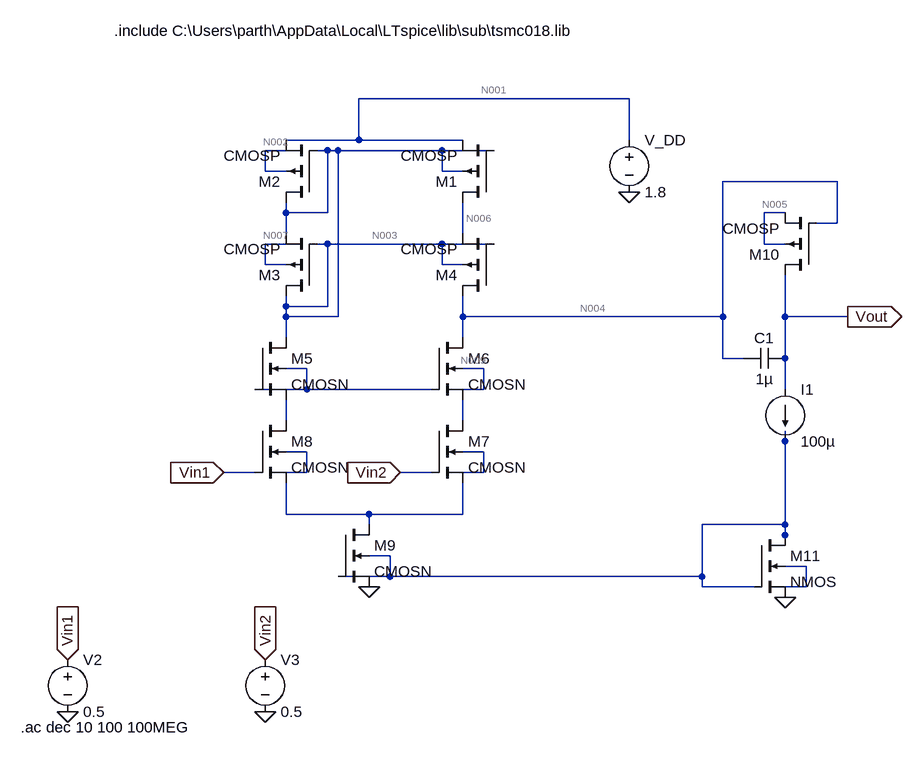
[diagram p0: schematic Draft2.asc]
Draft2.asc, the LTspice schematic file:
Version 4
SHEET 1 1312 1096
WIRE 864 112 448 112
WIRE 448 176 448 112
WIRE 448 176 336 176
WIRE 608 176 448 176
WIRE 864 176 864 112
WIRE 336 192 304 192
WIRE 400 192 384 192
WIRE 416 192 400 192
WIRE 576 192 416 192
WIRE 656 192 576 192
WIRE 304 224 304 192
WIRE 336 224 304 224
WIRE 576 224 576 192
WIRE 608 224 576 224
WIRE 1184 240 1008 240
WIRE 336 288 336 272
WIRE 400 288 400 192
WIRE 400 288 336 288
WIRE 1104 288 1072 288
WIRE 1184 304 1184 240
WIRE 1184 304 1152 304
WIRE 336 320 336 288
WIRE 608 320 608 272
WIRE 336 336 304 336
WIRE 400 336 384 336
WIRE 576 336 400 336
WIRE 656 336 576 336
WIRE 1072 336 1072 288
WIRE 1104 336 1072 336
WIRE 304 368 304 336
WIRE 336 368 304 368
WIRE 576 368 576 336
WIRE 608 368 576 368
WIRE 336 432 336 416
WIRE 400 432 400 336
WIRE 400 432 336 432
WIRE 336 448 336 432
WIRE 416 448 416 192
WIRE 416 448 336 448
WIRE 608 448 608 416
WIRE 1008 448 1008 240
WIRE 1008 448 608 448
WIRE 1104 448 1104 384
WIRE 1200 448 1104 448
WIRE 336 480 336 448
WIRE 608 480 608 448
WIRE 1008 512 1008 448
WIRE 1040 512 1008 512
WIRE 1104 512 1104 448
WIRE 368 528 336 528
WIRE 640 528 608 528
WIRE 368 560 368 528
WIRE 368 560 288 560
WIRE 560 560 368 560
WIRE 640 560 640 528
WIRE 640 560 608 560
WIRE 1104 560 1104 512
WIRE 336 608 336 576
WIRE 608 608 608 576
WIRE 1104 640 1104 624
WIRE 368 656 336 656
WIRE 640 656 608 656
WIRE 288 688 240 688
WIRE 368 688 368 656
WIRE 368 688 336 688
WIRE 560 688 512 688
WIRE 640 688 640 656
WIRE 640 688 608 688
WIRE 336 752 336 704
WIRE 464 752 336 752
WIRE 608 752 608 704
WIRE 608 752 464 752
WIRE 464 768 464 752
WIRE 1104 768 1104 640
WIRE 1104 768 976 768
WIRE 1104 784 1104 768
WIRE 1104 800 1104 784
WIRE 496 816 464 816
WIRE 1136 832 1104 832
WIRE 496 848 496 816
WIRE 496 848 416 848
WIRE 976 848 976 768
WIRE 976 848 496 848
WIRE 976 864 976 848
WIRE 1056 864 976 864
WIRE 1136 864 1136 832
WIRE 1136 864 1104 864
FLAG 464 864 0
FLAG 864 256 0
FLAG 1200 448 Vout
IOPIN 1200 448 Out
FLAG 240 688 Vin1
IOPIN 240 688 In
FLAG 512 688 Vin2
IOPIN 512 688 In
FLAG 0 976 Vin1
IOPIN 0 976 In
FLAG 304 976 Vin2
IOPIN 304 976 In
FLAG 0 1056 0
FLAG 304 1056 0
FLAG 1104 880 0
SYMBOL pmos4 656 272 R180
SYMATTR InstName M1
SYMATTR Value CMOSP
SYMATTR Value2 l=0.5u w=20u
SYMBOL pmos4 384 272 R180
SYMATTR InstName M2
SYMATTR Value CMOSP
SYMATTR Value2 l=0.5u w=20u
SYMBOL pmos4 384 416 R180
SYMATTR InstName M3
SYMATTR Value CMOSP
SYMATTR Value2 l=0.5u w=20u
SYMBOL pmos4 656 416 R180
SYMATTR InstName M4
SYMATTR Value CMOSP
SYMATTR Value2 l=0.5u w=20u
SYMBOL nmos4 288 480 R0
SYMATTR InstName M5
SYMATTR Value CMOSN
SYMATTR Value2 l=0.05u w=20u
SYMBOL nmos4 560 480 R0
SYMATTR InstName M6
SYMATTR Value CMOSN
SYMATTR Value2 l=0.05u w=20u
SYMBOL nmos4 560 608 R0
SYMATTR InstName M7
SYMATTR Value CMOSN
SYMATTR Value2 l=0.05u w=20u
SYMBOL nmos4 288 608 R0
SYMATTR InstName M8
SYMATTR Value CMOSN
SYMATTR Value2 l=0.05u w=20u
SYMBOL nmos4 416 768 R0
SYMATTR InstName M9
SYMATTR Value CMOSN
SYMATTR Value2 l=0.05u w=20u
SYMBOL voltage 864 160 R0
WINDOW 123 0 0 Left 0
WINDOW 39 0 0 Left 0
SYMATTR InstName V_DD
SYMATTR Value 1.8
SYMBOL pmos4 1152 384 R180
SYMATTR InstName M10
SYMATTR Value CMOSP
SYMATTR Value2 l=0.5u w=20u
SYMBOL current 1104 560 R0
WINDOW 123 0 0 Left 0
WINDOW 39 0 0 Left 0
SYMATTR InstName I1
SYMATTR Value 100µ
SYMBOL cap 1104 496 R90
WINDOW 0 0 32 VBottom 2
WINDOW 3 32 32 VTop 2
SYMATTR InstName C1
SYMATTR Value 1µ
SYMBOL voltage 0 960 R0
WINDOW 123 0 0 Left 0
WINDOW 39 0 0 Left 0
SYMATTR InstName V2
SYMATTR Value 0.5
SYMBOL voltage 304 960 R0
WINDOW 123 0 0 Left 0
WINDOW 39 0 0 Left 0
SYMATTR InstName V3
SYMATTR Value 0.5
SYMBOL nmos4 1056 784 R0
SYMATTR InstName M11
SYMATTR Value2 l=0.05u w=20u
TEXT 72 8 Left 2 !.include C:\\Users\\parth\\AppData\\Local\\LTspice\\lib\\sub\\tsmc018.lib
TEXT -72 1080 Left 2 !.ac dec 10 100 100MEG

The netlist it stands for:
* Draft2.asc
M1 N006 N003 N001 N003 CMOSP l=0.5u w=20u
M2 N003 N003 N001 N002 CMOSP l=0.5u w=20u
M3 N003 N003 N003 N007 CMOSP l=0.5u w=20u
M4 N004 N003 N006 N003 CMOSP l=0.5u w=20u
M5 N003 N008 N010 N008 CMOSN l=0.05u w=20u
M6 N004 N008 N011 N009 CMOSN l=0.05u w=20u
M7 N011 Vin2 N015 N014 CMOSN l=0.05u w=20u
M8 N010 Vin1 N015 N013 CMOSN l=0.05u w=20u
M9 N015 N012 0 N012 CMOSN l=0.05u w=20u
V_DD N001 0 1.8
M10 Vout N004 N005 N005 CMOSP l=0.5u w=20u
I1 Vout N012 100µ
C1 Vout N004 1µ
V2 Vin1 0 0.5
V3 Vin2 0 0.5
M11 N012 N012 0 N016 NMOS l=0.05u w=20u
.model NMOS NMOS
.model PMOS PMOS
.lib standard.mos
.include C:\Users\parth\AppData\Local\LTspice\lib\sub\tsmc018.lib
.ac dec 10 100 100MEG
.backanno
.end

* Results of the author's LTspice run, read from the files saved beside the schematic
* Operating Point, zero values left out:
*   V(n006) = 1.776 V
*   V(n003) = 1.799 V
*   V(n001) = 1.8 V
*   V(n002) = 1.688 V
*   V(n007) = 1.687 V
*   V(n004) = -479.8 mV
*   V(n009) = -376 mV
*   V(vin2) = 500 mV
*   V(vin1) = 500 mV
*   V(vout) = -200 MV
*   V(n005) = -100 MV
*   Id(M1) = -27.85 pA
*   Is(M1) = 27.83 pA
*   Id(M2) = -5.847 pA
*   Ib(M2) = -1.688 pA
*   Is(M2) = 7.535 pA
*   Ib(M3) = -1.687 pA
*   Id(M4) = -30.17 pA
*   Ib(M4) = 2.317 pA
*   Is(M4) = 27.85 pA
*   Id(M10) = -100 µA
*   Ib(M10) = 100 µA
*   Id(M5) = 1.817 pA
*   Is(M5) = -1.778 pA
*   Id(M6) = -169.8 pA
*   Is(M6) = 169.5 pA
*   Id(M7) = -169.5 pA
*   Is(M7) = 169.4 pA
*   Id(M8) = 1.778 pA
*   Is(M8) = -1.849 pA
*   Id(M9) = -167.5 pA
*   Ib(M9) = 171.9 pA
*   Is(M9) = -4.393 pA
*   Id(M11) = 100 µA
*   Is(M11) = -100 µA
*   I(C1) = -200 pA
*   I(I1) = 100 µA
*   I(V_dd) = -35.36 pA